# Altium project 2019_SCANNER_VL53.PRJPCB
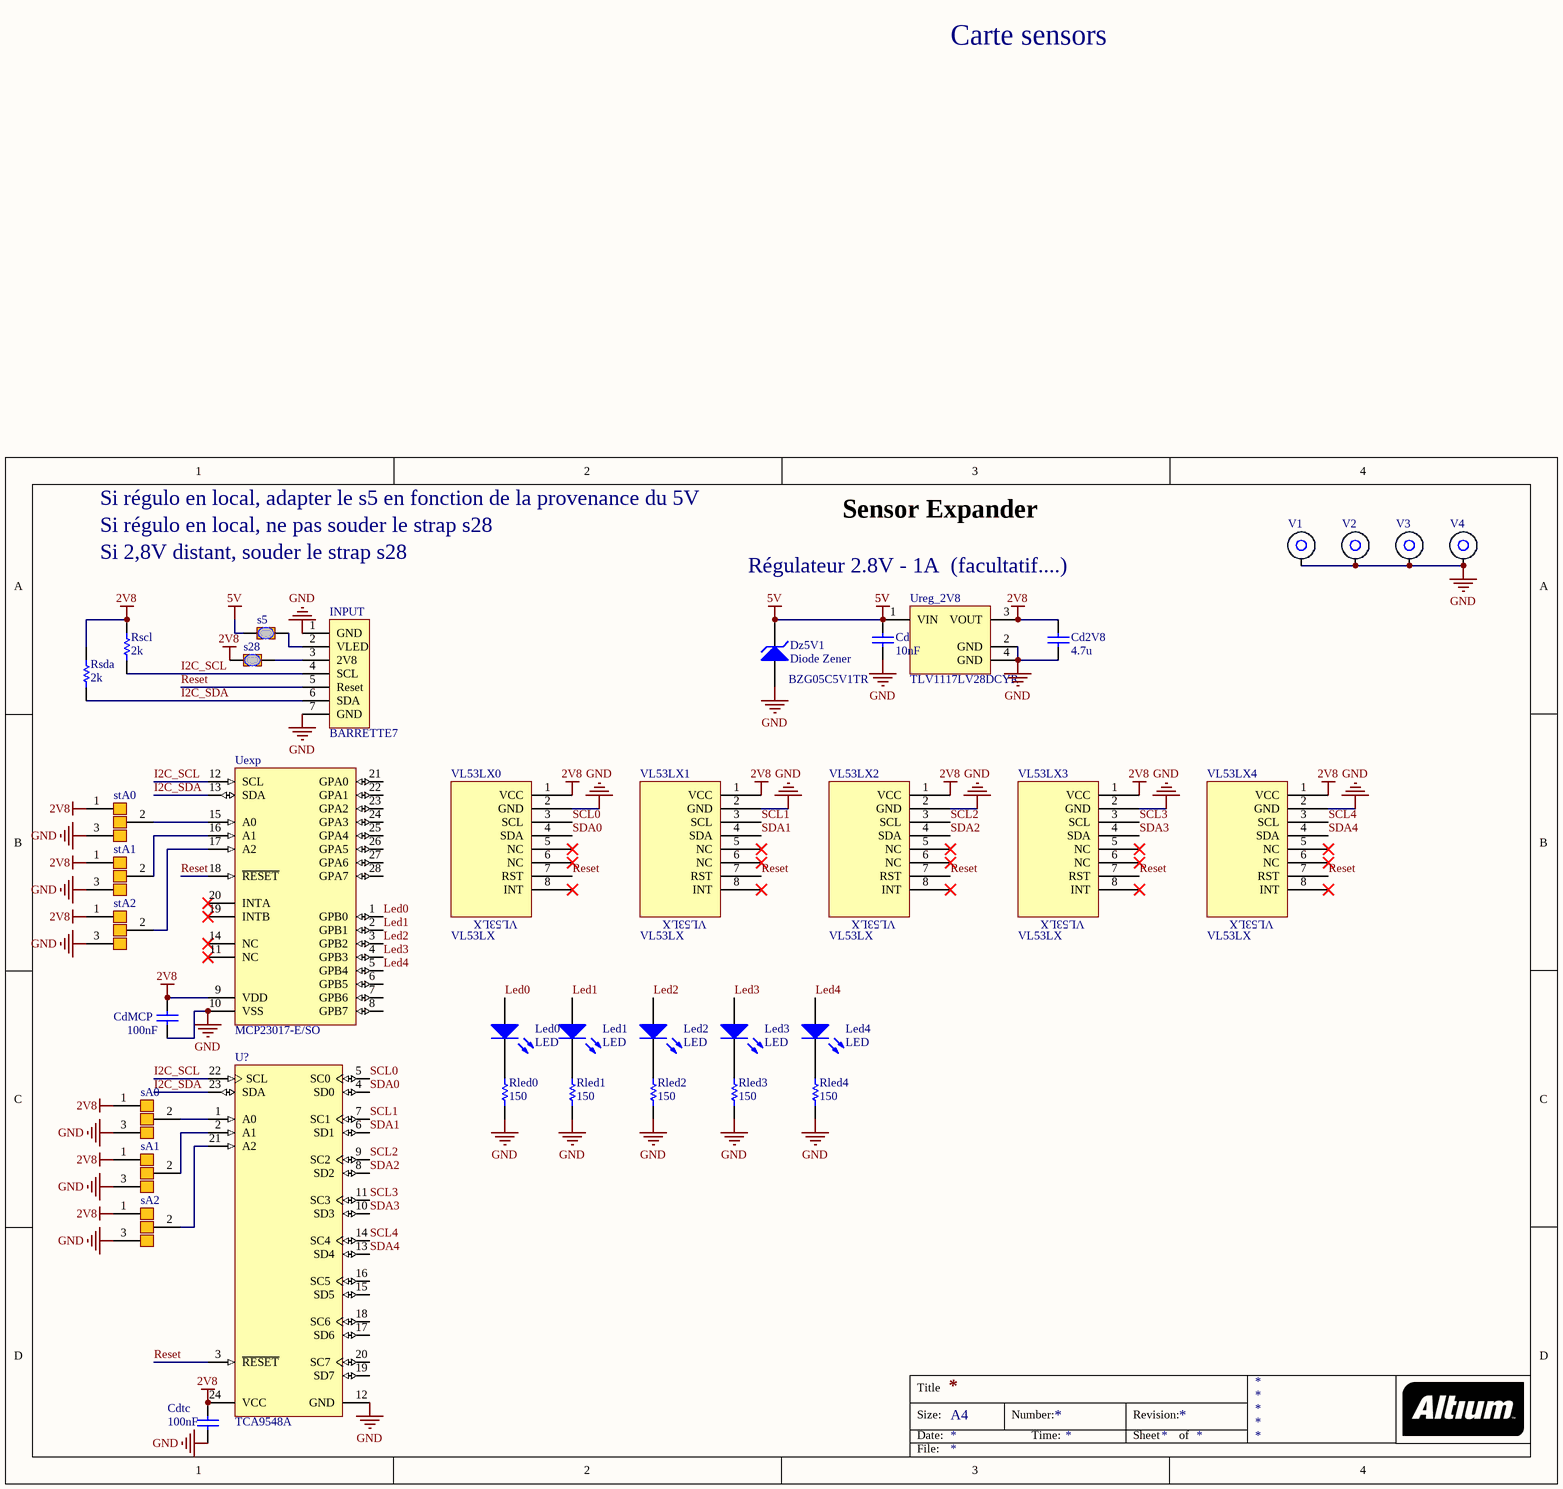
[diagram p0: 2019_SCANNER_VL53.SchDoc]
1 sheet, 38 parts. Net scope: global (net labels, ports and power ports of the same name join across sheets).
Board file: 2019_SCANNER_VL53.PCBDOC

## Sheet 2019_SCANNER_VL53.SchDoc
size A4

### Parts
Cd  10nF  [C0805_N]
Cd2V8  4.7u  [C1206_N]
CdMCP  100nF  [C0805_N]
Cdtc  100nF  [C0805_N]
Dz5V1  Diode Zener  [SMA Diode]
INPUT  BARRETTE7  [MOLEX7_2.50MM]
Led0  LED  [LED_0805]
Led1  LED  [LED_0805]
Led2  LED  [LED_0805]
Led3  LED  [LED_0805]
Led4  LED  [LED_0805]
Rled0  150  [R1206_N]
Rled1  150  [R1206_N]
Rled2  150  [R1206_N]
Rled3  150  [R1206_N]
Rled4  150  [R1206_N]
Rscl  2k  [R1206_N]
Rsda  2k  [R1206_N]
s5  Goutte Strap_2  [Goutte Strap_2 Pads_Clearance 0.254mm]  (value not drawn)
s28  Goutte Strap_2  [Goutte Strap_2 Pads_Clearance 0.254mm]  (value not drawn)
sA0  Goutte Strap_3  [Goutte Strap_3 PADS]  (value not drawn)
sA1  Goutte Strap_3  [Goutte Strap_3 PADS]  (value not drawn)
sA2  Goutte Strap_3  [Goutte Strap_3 PADS]  (value not drawn)
stA0  Goutte Strap_3  [Goutte Strap_3 PADS]  (value not drawn)
stA1  Goutte Strap_3  [Goutte Strap_3 PADS]  (value not drawn)
stA2  Goutte Strap_3  [Goutte Strap_3 PADS]  (value not drawn)
U?  TCA9548A  [DB24_N]
Uexp  MCP23017-E/SO  [SOIC-SO28_N]
Ureg_2V8  TLV1117LV28DCYR  [SOT223-4N]
V1  Entretoise WURTH CMS  [ENTRETOISE_CMS]  (value not drawn)
V2  Entretoise WURTH CMS  [ENTRETOISE_CMS]  (value not drawn)
V3  Entretoise WURTH CMS  [ENTRETOISE_CMS]  (value not drawn)
V4  Entretoise WURTH CMS  [ENTRETOISE_CMS]  (value not drawn)
VL53LX0  VL53LX  [VL53LX]
VL53LX1  VL53LX  [VL53LX]
VL53LX2  VL53LX  [VL53LX]
VL53LX3  VL53LX  [VL53LX]
VL53LX4  VL53LX  [VL53LX]

### Nets
2V8: Cd2V8.2 CdMCP.2 Cdtc.2 Rscl.1 Rsda.1 s28.1 sA0.1 sA1.1 sA2.1 stA0.1 stA1.1 stA2.1 U?.24(VCC) Uexp.9(VDD) Ureg_2V8.3(VOUT) VL53LX0.1(VCC) VL53LX1.1(VCC) VL53LX2.1(VCC) VL53LX3.1(VCC) VL53LX4.1(VCC)
5V: Cd.2 Dz5V1.2(K) s5.1 Ureg_2V8.1(VIN)
GND: Cd.1 Cd2V8.1 CdMCP.1 Cdtc.1 Dz5V1.1(A) INPUT.1(GND) INPUT.7(GND) Rled0.2 Rled1.2 Rled2.2 Rled3.2 Rled4.2 sA0.3 sA1.3 sA2.3 stA0.3 stA1.3 stA2.3 U?.12(GND) Uexp.10(VSS) Ureg_2V8.2(GND) Ureg_2V8.4(GND) V1.1 V2.1 V3.1 V4.1 VL53LX0.2(GND) VL53LX1.2(GND) VL53LX2.2(GND) VL53LX3.2(GND) VL53LX4.2(GND)
I2C_SCL: INPUT.4(SCL) Rscl.2 U?.22(SCL) Uexp.12(SCL)
I2C_SDA: INPUT.6(SDA) Rsda.2 U?.23(SDA) Uexp.13(SDA)
Led0: Led0.1(A) Uexp.1(GPB0)
Led1: Led1.1(A) Uexp.2(GPB1)
Led2: Led2.1(A) Uexp.3(GPB2)
Led3: Led3.1(A) Uexp.4(GPB3)
Led4: Led4.1(A) Uexp.5(GPB4)
Reset: INPUT.5(Reset) U?.3(~{RESET}) Uexp.18(~{RESET}) VL53LX0.7(RST) VL53LX1.7(RST) VL53LX2.7(RST) VL53LX3.7(RST) VL53LX4.7(RST)
SCL0: U?.5(SC0) VL53LX0.3(SCL)
SCL1: U?.7(SC1) VL53LX1.3(SCL)
SCL2: U?.9(SC2) VL53LX2.3(SCL)
SCL3: U?.11(SC3) VL53LX3.3(SCL)
SCL4: U?.14(SC4) VL53LX4.3(SCL)
SDA0: U?.4(SD0) VL53LX0.4(SDA)
SDA1: U?.6(SD1) VL53LX1.4(SDA)
SDA2: U?.8(SD2) VL53LX2.4(SDA)
SDA3: U?.10(SD3) VL53LX3.4(SDA)
SDA4: U?.13(SD4) VL53LX4.4(SDA)
NetINPUT_2: INPUT.2(VLED) s5.2
NetINPUT_3: INPUT.3(2V8) s28.2
NetLed0_2: Led0.2(K) Rled0.1
NetLed1_2: Led1.2(K) Rled1.1
NetLed2_2: Led2.2(K) Rled2.1
NetLed3_2: Led3.2(K) Rled3.1
NetLed4_2: Led4.2(K) Rled4.1
NetsA0_2: sA0.2 U?.1(A0)
NetsA1_2: sA1.2 U?.2(A1)
NetsA2_2: sA2.2 U?.21(A2)
NetstA0_2: stA0.2 Uexp.15(A0)
NetstA1_2: stA1.2 Uexp.16(A1)
NetstA2_2: stA2.2 Uexp.17(A2)

Not connected (* = marked no-connect by the designer): U? 15(SD5) 16(SC5) 17(SD6) 18(SC6) 19(SD7) 20(SC7); Uexp 6(GPB5) 7(GPB6) 8(GPB7) 11(NC)* 14(NC)* 19(INTB)* 20(INTA)* 21(GPA0) 22(GPA1) 23(GPA2) 24(GPA3) 25(GPA4) 26(GPA5) 27(GPA6) 28(GPA7); VL53LX0 5(NC)* 6(NC)* 8(INT)*; VL53LX1 5(NC)* 6(NC)* 8(INT)*; VL53LX2 5(NC)* 6(NC)* 8(INT)*; VL53LX3 5(NC)* 6(NC)* 8(INT)*; VL53LX4 5(NC)* 6(NC)* 8(INT)*

### Notes on the sheet
- Carte sensors
- Si régulo en local, ne pas souder le strap s28
- Si 2,8V distant, souder le strap s28
- Si régulo en local, adapter le s5 en fonction de la provenance du 5V
- Sensor Expander
- Régulateur 2.8V - 1A  (facultatif....)
- Title
- Size:
- Date:
- A4
- Number:
- Time:
- Revision:
- Sheet
- of
- File:
- (in symbol Diode Zener) BZG05C5V1TR

### Library data of the parts
Cd CdMCP Cdtc = Condensateur: Capacitor; Published: 8-Jun-2000; LatestRevisionDate: 17-Jul-2002; LatestRevisionNote: Re-released for DXP Platform.; PackageReference: RAD-0.3; Publisher: Altium Limited
Cd2V8 = Capacitor: Published: 8-Jun-2000; LatestRevisionDate: 17-Jul-2002; LatestRevisionNote: Re-released for DXP Platform.; PackageReference: RAD-0.3; Publisher: Altium Limited
Dz5V1 = Diode Zener: Zener Diode
INPUT = BARRETTE7: Header, 6-Pin; LatestRevisionDate: 17-Jul-2002; LatestRevisionNote: Re-released for DXP Platform.; Publisher: Altium Limited
Led0-Led4 = LED: Typical LED; Published: 8-Jun-2000; LatestRevisionDate: 08-Jul-2005; LatestRevisionNote: Mech Layer 1 removed.; PackageReference: LED-1; Publisher: Altium Limited
Rled0-Rled4 Rscl Rsda = Resistor: Published: 8-Jun-2000; LatestRevisionDate: 17-Jul-2002; LatestRevisionNote: Re-released for DXP Platform.; PackageReference: AXIAL-0.5; Publisher: Altium Limited
U? = PCA9548ADB: 8-Channel I2C Switch with Reset, 2.3 to 5.5 V, -40 to 85 degC, 24-pin SSOP (DB), Green (RoHS & no Sb/Br); Manufacturer: Texas Instruments; SubFamily: I2C Multiplexer, Switch; Technology Family: PCA; fSCLK(Max)(MHz): 100, 400; VCC(Min)(V): 2.3; VCC(Max)(V): 5.5; Max Frequency(kHz): 400; I2C Address: 1110 xxx; Channel Width: 8; Reset Input: Yes; Simultaneously Active Channels: 1 to 8; DatasheetVersion: SCPS143C; PackageVersion: revE, Dec-2001; PackageReference: DB24; PackageDescription: 24-Pin Plastic Small Outline Package, 8.2 x 5.3 mm Body, 0.65 mm Pitch; Supplier 1: Digi-Key; Supplier Part Number 1: PCA9548ADB-ND; Supplier 2: Farnell; Supplier Part Number 2: 1574999; Supplier 3: Newark; Supplier Part Number 3: 22M1598; Supplier 4: Mouser; Supplier Part Number 4: 595-PCA9548ADB; Eco-Plan: Green (RoHS & no Sb/Br); Vcc range(V): 2.3 to 5.5; 5V Tolerant I/O: Yes; Open Drain I/O Type: Yes; Mounting Technology: Surface Mount; PartNumber: PCA9548ADB; Code_JEDEC: MO-150; ComponentLink1Description: Datasheet; ComponentLink1URL: http://www.ti.com/general/docs/lit/getliterature.tsp?genericPartNumber=PCA9548A&fileType=pdf; ComponentLink2Description: Package Specification; ComponentLink2URL: http://www.ti.com/litv/pdf/mpds211a
Uexp = MCP23017-E/SO: 16-Bit I/O Expander with Serial Interface, 28-Pin SOIC, Extended Temperature; Manufacturer: Microchip; DatasheetVersion: revB, Feb-2007; PackageVersion: revBB, Aug-2009; PackageReference: SOIC-SO28; PackageDescription: 28-Lead Plastic Small Outline (SO) - Wide 7.50mm Body [SOIC]; Supplier 1: Digi-Key; Supplier Part Number 1: MCP23017-E/SO-ND; Supplier 2: Farnell; Supplier Part Number 2: 1332087; Supplier 3: Newark; Supplier Part Number 3: 31K2958; Supplier 4: Newark; Supplier Part Number 4: 34M7442; Supplier 5: Mouser; Supplier Part Number 5: 579-MCP23017-E/SO; Mounting Technology: Surface Mount; Code_JEDEC: MS-013; PartNumber: MCP23017-E/SO; ComponentLink1Description: Manufacturer URL; ComponentLink1URL: http://www.microchip.com/; ComponentLink2Description: Datasheet; ComponentLink2URL: http://ww1.microchip.com/downloads/en/DeviceDoc/21952b.pdf; ComponentLink3Description: Package Specification; ComponentLink3URL: http://www.microchip.com/stellent/groups/techpub_sg/documents/packagingspec/en012702.pdf
Ureg_2V8 = MCP1826S-3302E/DB: 1000 mA, Low Voltage, Low Quiescent Current LDO Regulator, 3-Pin SOT-223, Extended Temperature; FirstPublished: 29-Jan-2009; DatasheetVersion: revA, Aug-2007; PackageVersion: revBB, Aug-2009; PackageReference: SOT-223-DB3; Publisher: Altium Limited; PackageDescription: 3-Lead Plastic Small Outline Transistor (DB) [SOT-223]; Supplier 1: Digi-Key; Supplier Part Number 1: MCP1826S-3302E/DB-ND; Supplier 2: Farnell; Supplier Part Number 2: 1578424; Supplier 3: Newark; Supplier Part Number 3: 27M0037; ComponentLink1Description: Datasheet; ComponentLink1URL: http://ww1.microchip.com/downloads/en/DeviceDoc/22057a.pdf; ComponentLink2Description: Packaging Specification; ComponentLink2URL: http://www.microchip.com/stellent/groups/techpub_sg/documents/packagingspec/en012702.pdf; ComponentLink3Description: Microchip.com Home; ComponentLink3URL: http://www.microchip.com/
V1-V4 = Entretoise WURTH CMS: Entretoise Wurth; Publisher: Damien Guitton
s5 s28 = Goutte Strap_2: LatestRevisionDate: 30/01/11; Publisher: Damien Guitton
sA0-sA2 stA0-stA2 = Goutte Strap_3: LatestRevisionDate: 25/11/09; Publisher: Damien Guitton